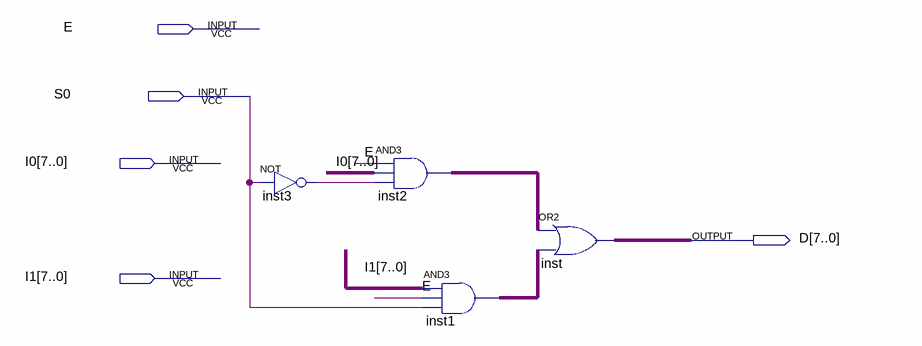
[diagram p0: schematic sheet]
// Quartus schematic mp2-1.bdf as structural Verilog: 4 symbols, 5 pins
module \mp2-1  (
  input  E,
  input  S0,
  input  [7:0] I0,
  input  [7:0] I1,
  output [7:0] D
);

  wire inst3_out;
  wire [7:0] inst1_out, inst2_out;

  not inst3 (inst3_out, S0);
  assign inst2_out = {8{E}} & I0 & {8{inst3_out}};  // AND3 inst2, 8 bits wide
  assign inst1_out = I1 & {8{E}} & {8{S0}};  // AND3 inst1, 8 bits wide
  assign D = inst2_out | inst1_out;  // OR2 inst, 8 bits wide
endmodule
